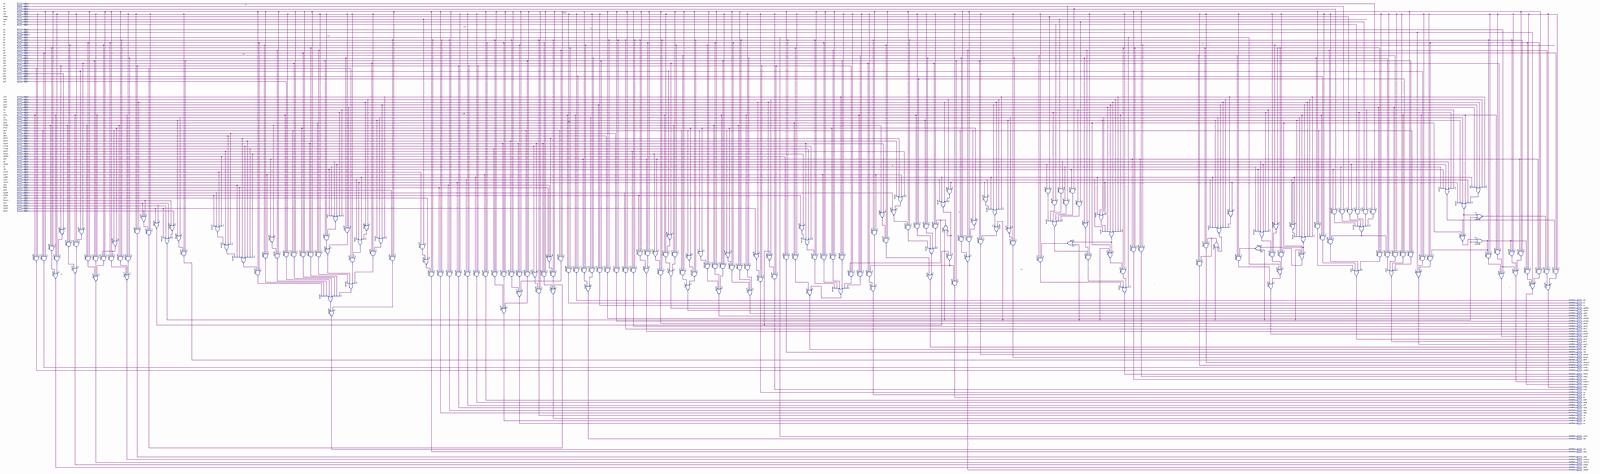
[diagram p0: schematic sheet, whole]
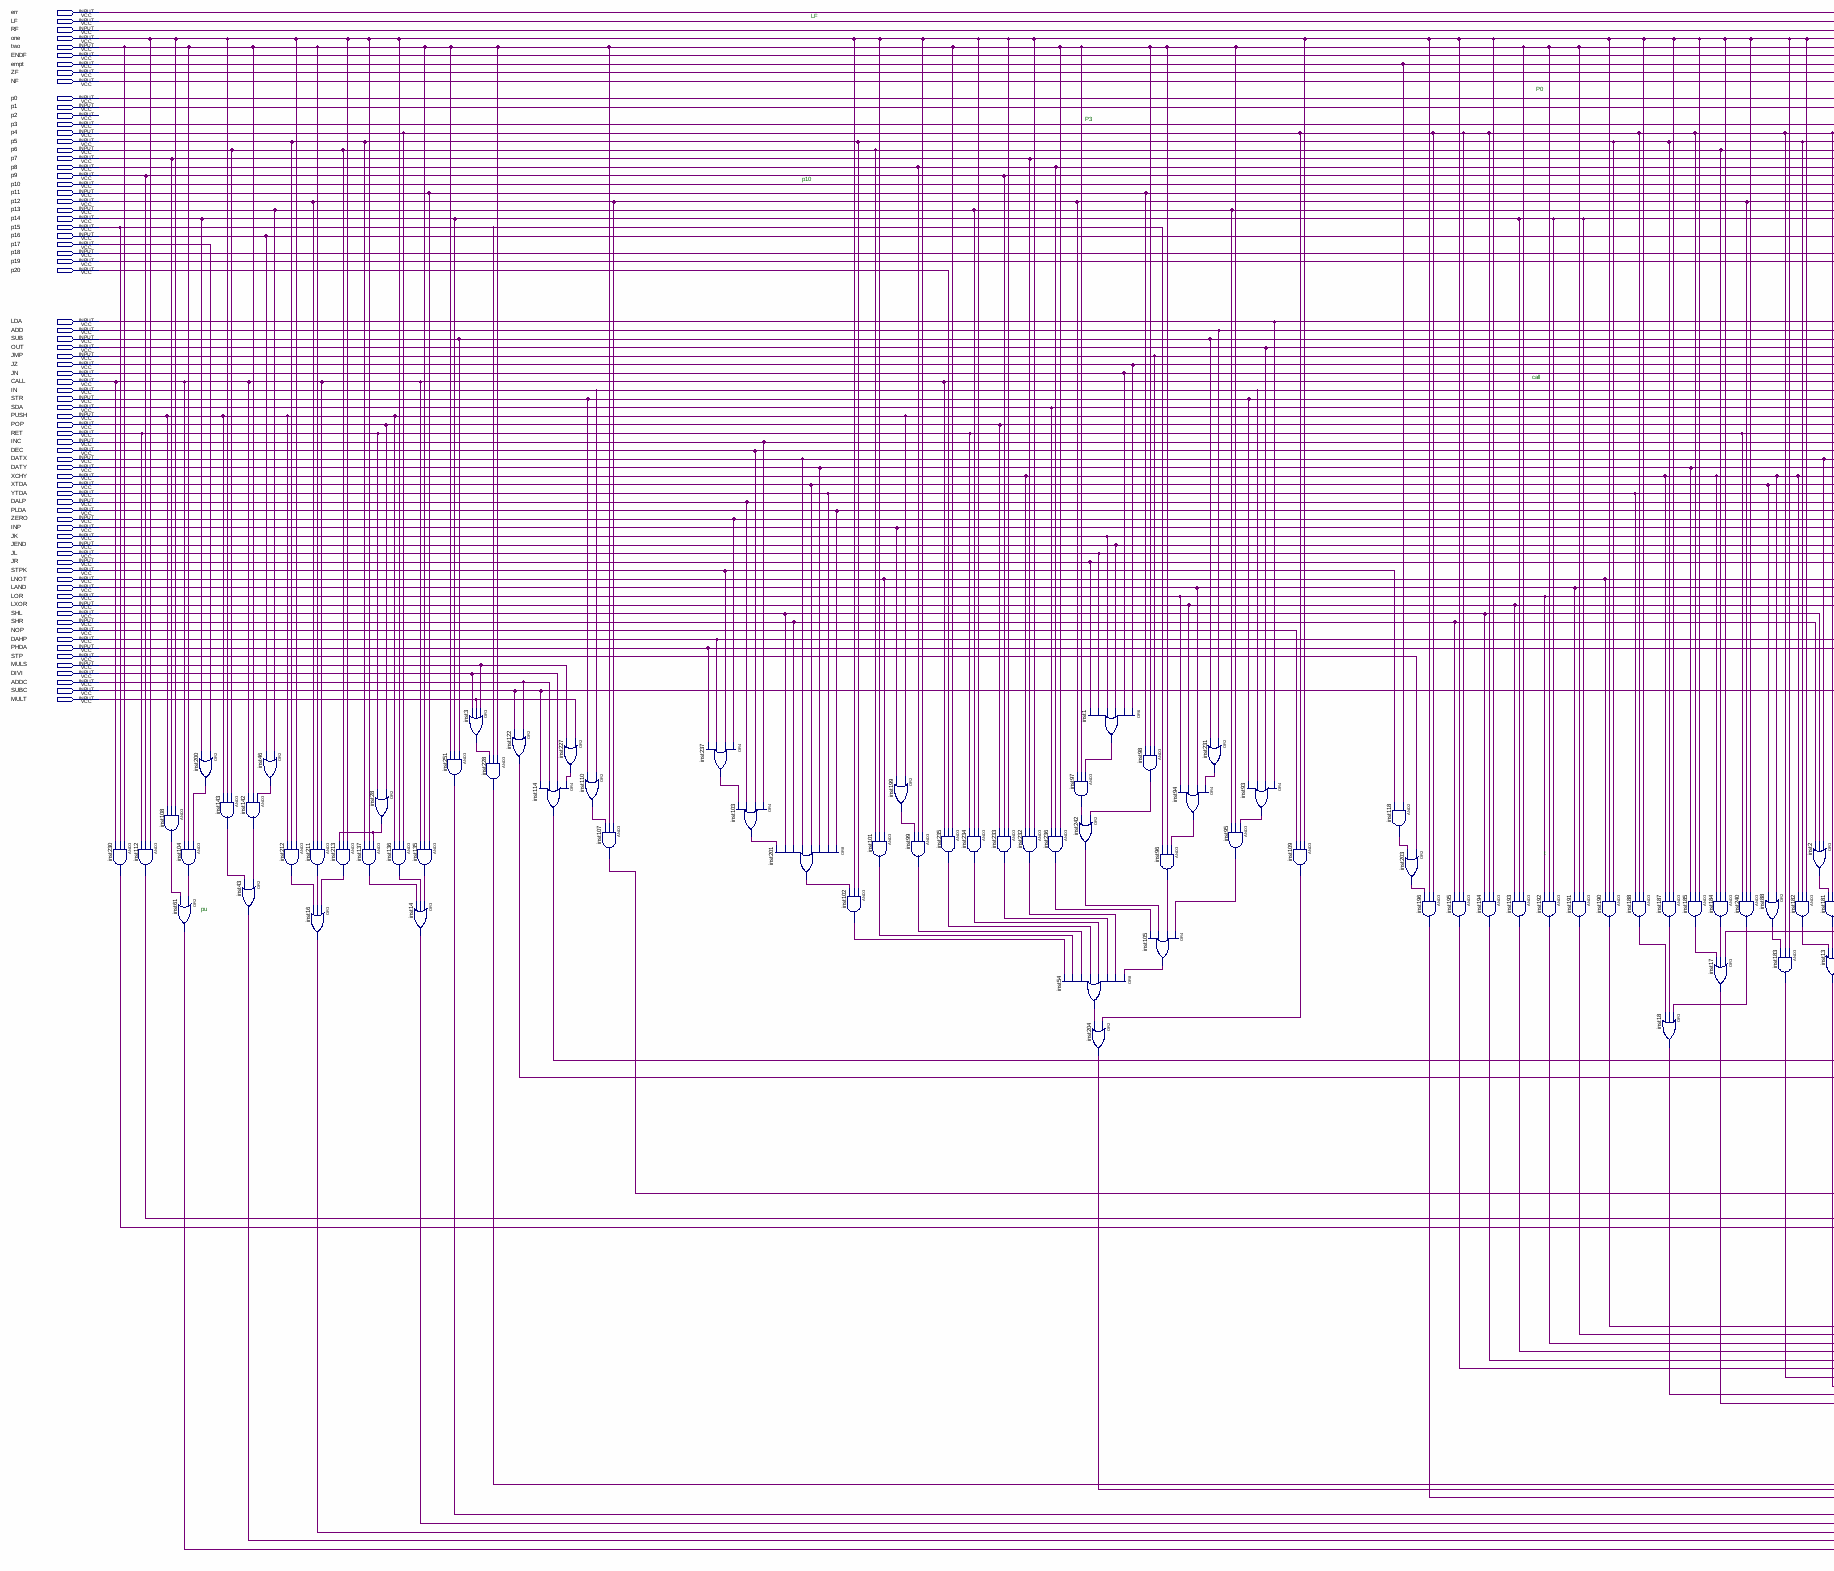
[diagram p1: schematic sheet, left part]
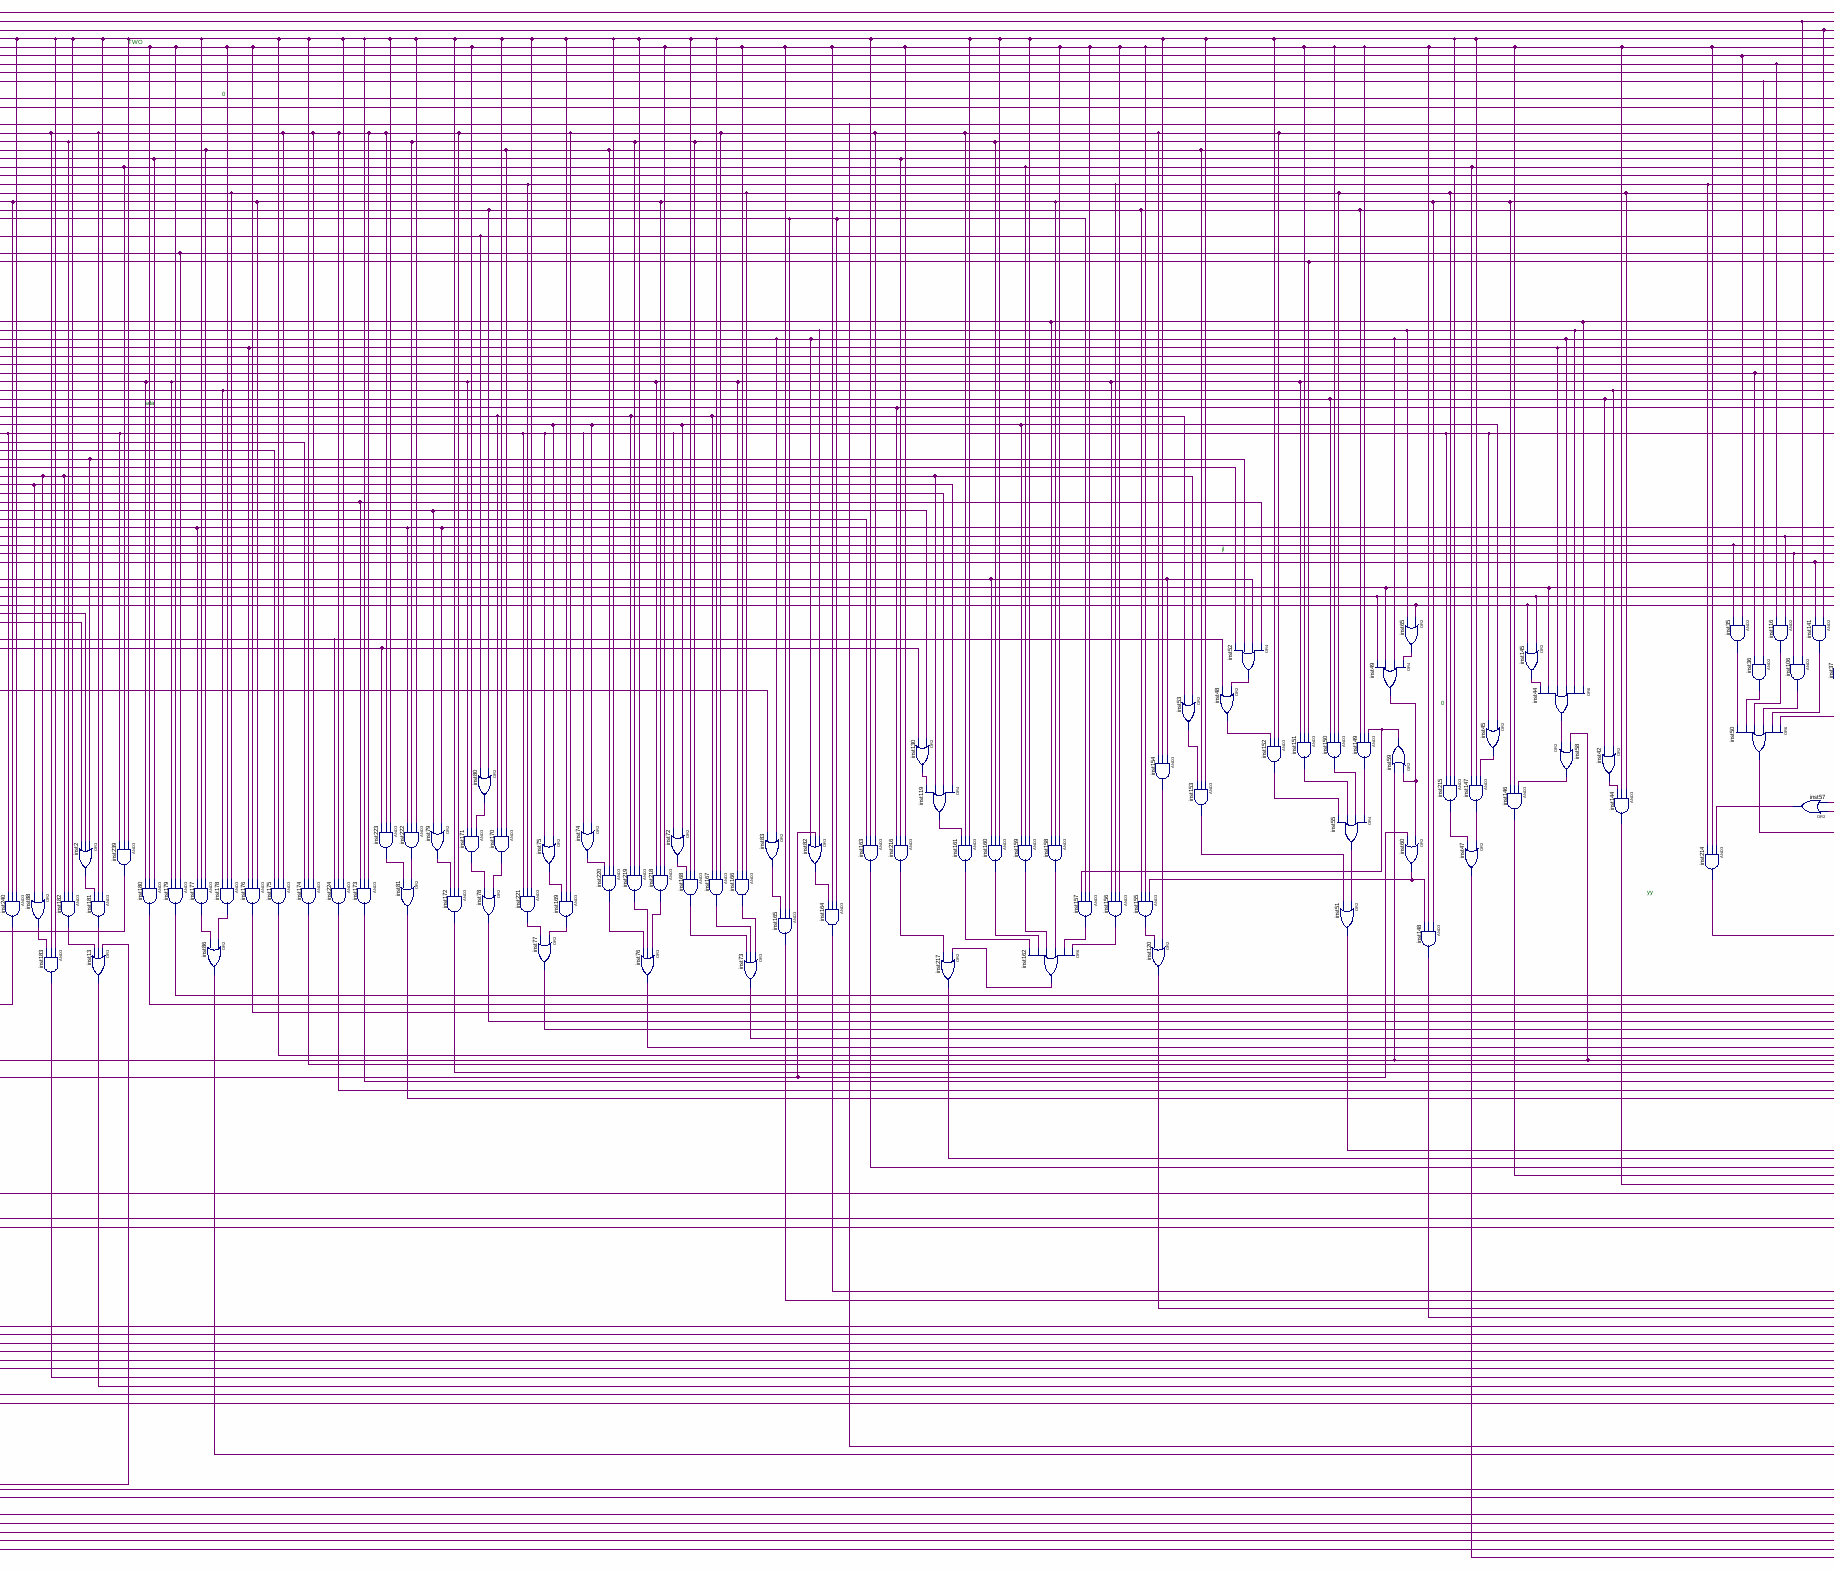
[diagram p2: schematic sheet, centre part]
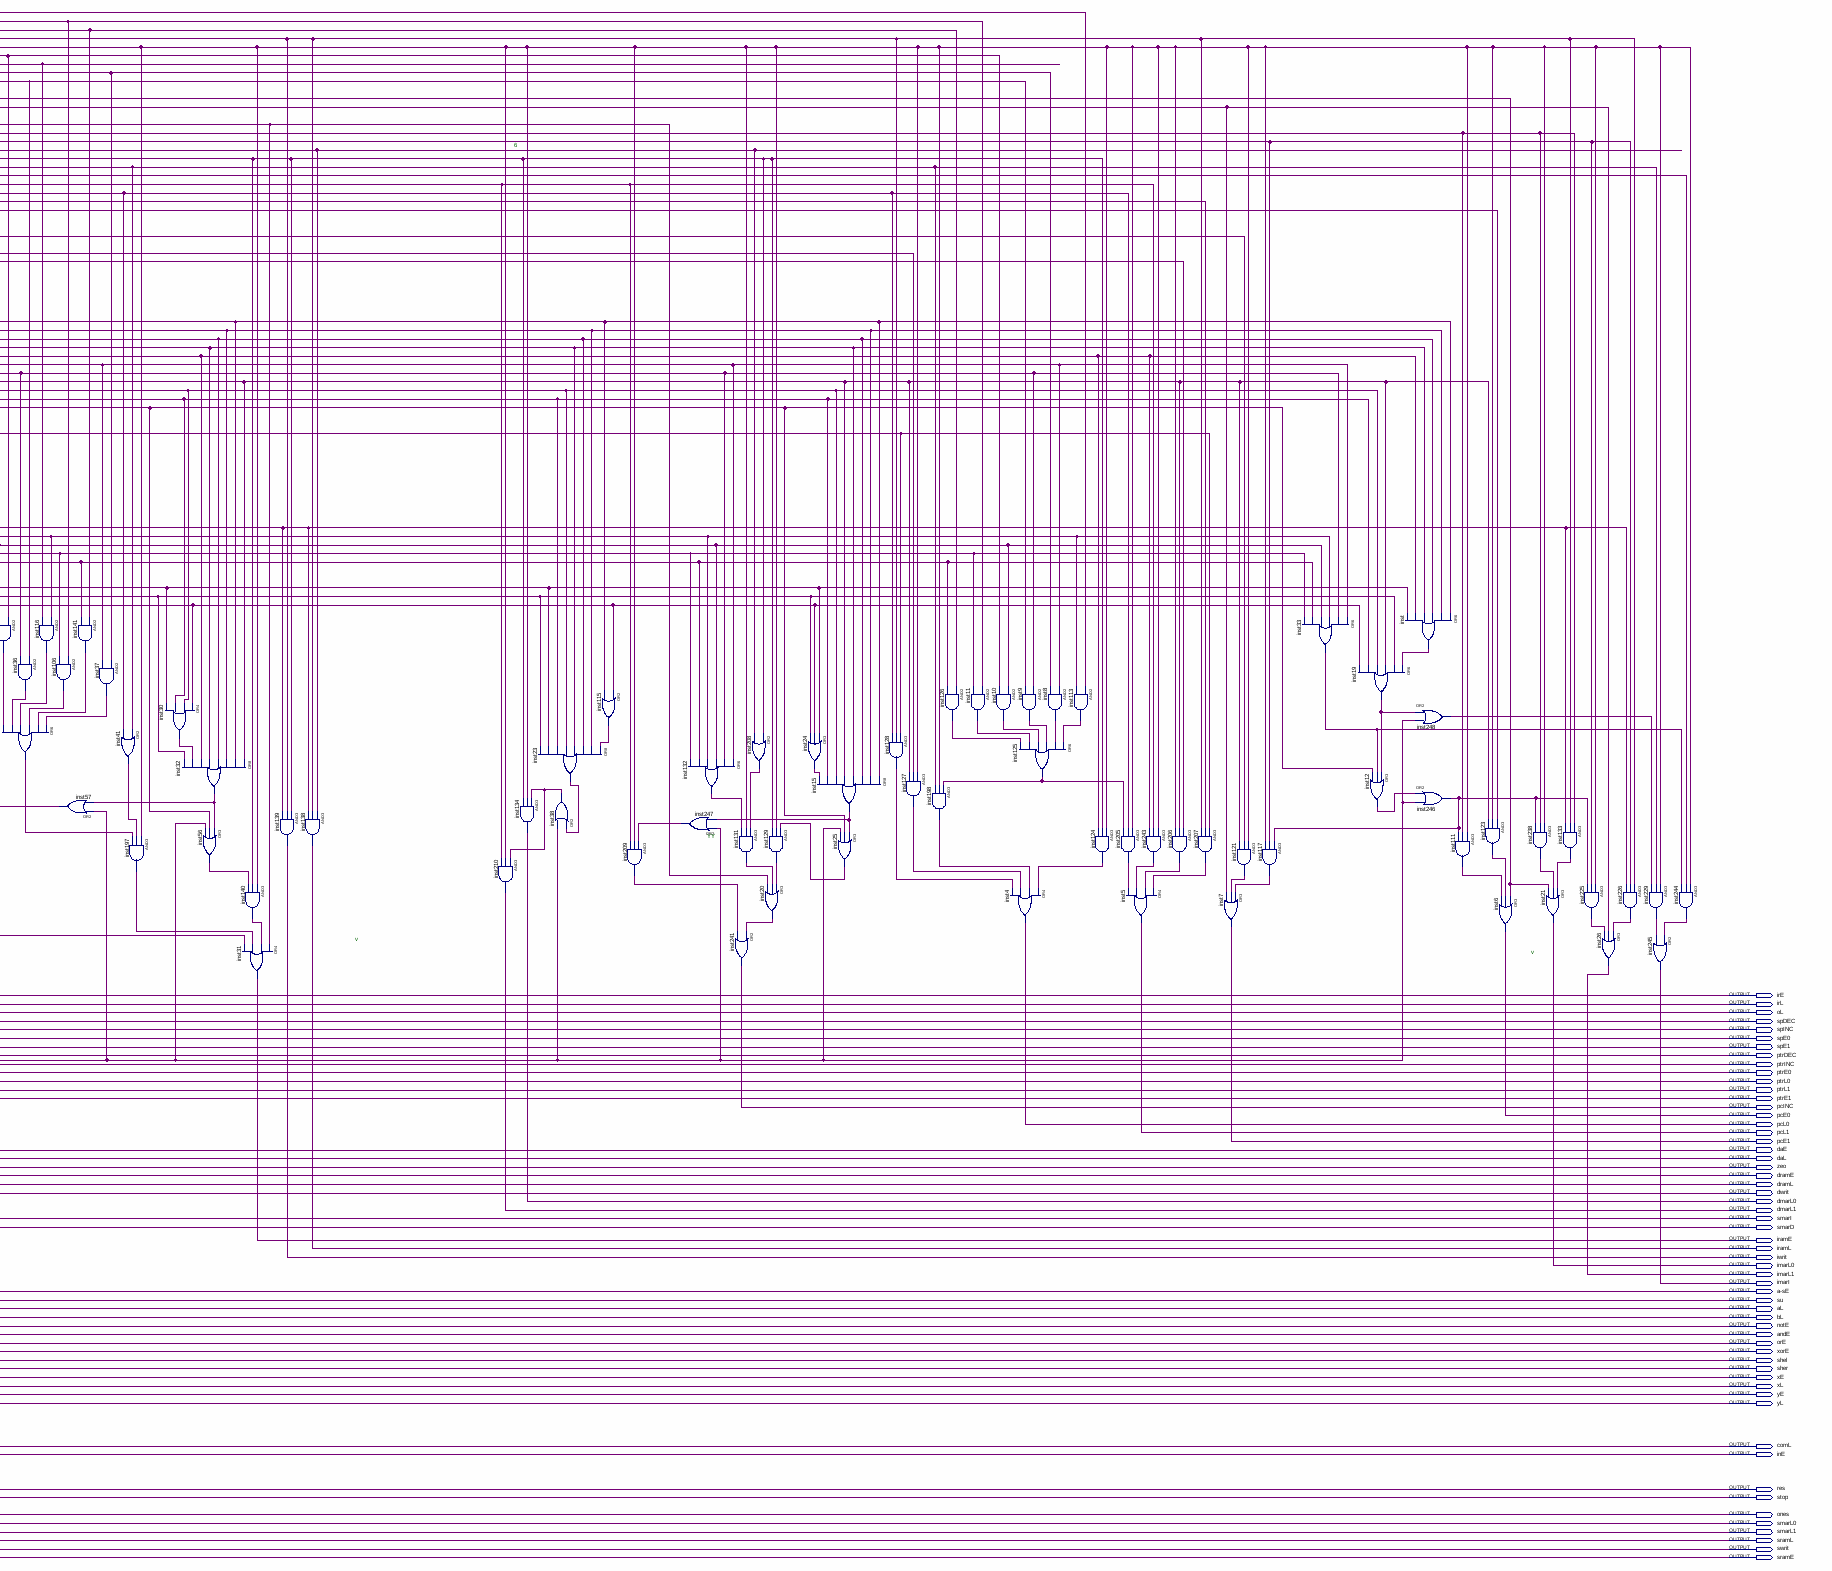
[diagram p3: schematic sheet, right part]
// Quartus schematic kzjz.bdf as structural Verilog: 224 symbols, 133 pins
module kzjz (
  input  err,
  input  LF,
  input  RF,
  input  one,
  input  two,
  input  ENDF,
  input  empt,
  input  ZF,
  input  NF,
  input  p0,
  input  p1,
  input  p2,
  input  p3,
  input  p4,
  input  p5,
  input  p6,
  input  p7,
  input  p8,
  input  p9,
  input  p10,
  input  p11,
  input  p12,
  input  p13,
  input  p14,
  input  p15,
  input  p16,
  input  p17,
  input  p18,
  input  p19,
  input  p20,
  input  LDA,
  input  ADD,
  input  SUB,
  input  OUT,
  input  JMP,
  input  JZ,
  input  JN,
  input  CALL,
  input  IN,
  input  STR,
  input  SDA,
  input  PUSH,
  input  POP,
  input  RET,
  input  INC,
  input  DEC,
  input  DATX,
  input  DATY,
  input  XCHY,
  input  XTDA,
  input  YTDA,
  input  DALP,
  input  PLDA,
  input  ZERO,
  input  INP,
  input  JK,
  input  JEND,
  input  JL,
  input  JR,
  input  STPK,
  input  LNOT,
  input  LAND,
  input  LOR,
  input  LXOR,
  input  SHL,
  input  SHR,
  input  NOP,
  input  DAHP,
  input  PHDA,
  input  STP,
  input  MULS,
  input  DIVI,
  input  ADDC,
  input  SUBC,
  input  MULT,
  output irE,
  output irL,
  output oL,
  output spDEC,
  output spINC,
  output spE0,
  output spE1,
  output ptrDEC,
  output ptrINC,
  output ptrE0,
  output ptrL0,
  output ptrL1,
  output ptrE1,
  output pcINC,
  output pcE0,
  output pcL0,
  output pcL1,
  output pcE1,
  output daE,
  output daL,
  output zeo,
  output dramE,
  output dramL,
  output dwrit,
  output dmarL0,
  output dmarL1,
  output smarI,
  output smarD,
  output iramE,
  output iramL,
  output iwrit,
  output imarL0,
  output imarL1,
  output imarI,
  output \a-sE ,
  output su,
  output aL,
  output bL,
  output notE,
  output andE,
  output orE,
  output xorE,
  output shel,
  output sher,
  output xE,
  output xL,
  output yE,
  output yL,
  output comL,
  output inE,
  output res,
  output stop,
  output ones,
  output smarL0,
  output smarL1,
  output sramL,
  output swrit,
  output sramE
);

  wire inst1_out, inst2_out, inst3_out, inst8_out, inst9_out, inst10_out, inst11_out, inst12_out, inst15_out,
       inst19_out, inst20_out, inst23_out, inst24_out, inst25_out, inst28_out, inst30_out, inst32_out,
       inst33_out, inst35_out, inst36_out, inst37_out, inst38_out, inst41_out, inst42_out, inst44_out,
       inst45_out, inst46_out, inst48_out, inst49_out, inst50_out, inst52_out, inst53_out, inst54_out,
       inst55_out, inst56_out, inst57_out, inst58_out, inst59_out, inst60_out, inst65_out, inst72_out,
       inst74_out, inst75_out, inst79_out, inst80_out, inst82_out, inst83_out, inst88_out, inst93_out,
       inst94_out, inst95_out, inst96_out, inst97_out, inst98_out, inst99_out, inst101_out, inst102_out,
       inst103_out, inst104_out, inst105_out, inst106_out, inst108_out, inst109_out, inst110_out,
       inst111_out, inst113_out, inst114_out, inst115_out, inst116_out, inst117_out, inst118_out,
       inst119_out, inst121_out, inst122_out, inst123_out, inst124_out, inst125_out, inst126_out,
       inst127_out, inst128_out, inst129_out, inst130_out, inst131_out, inst132_out, inst133_out,
       inst135_out, inst136_out, inst137_out, inst140_out, inst141_out, inst142_out, inst143_out,
       inst145_out, inst147_out, inst149_out, inst150_out, inst151_out, inst152_out, inst153_out,
       inst154_out, inst155_out, inst156_out, inst157_out, inst158_out, inst159_out, inst160_out,
       inst161_out, inst162_out, inst166_out, inst167_out, inst168_out, inst169_out, inst170_out,
       inst171_out, inst177_out, inst178_out, inst181_out, inst182_out, inst184_out, inst185_out,
       inst187_out, inst188_out, inst197_out, inst198_out, inst199_out, inst200_out, inst201_out,
       inst203_out, inst205_out, inst206_out, inst207_out, inst208_out, inst209_out, inst211_out,
       inst212_out, inst213_out, inst214_out, inst215_out, inst216_out, inst218_out, inst219_out,
       inst220_out, inst221_out, inst222_out, inst223_out, inst225_out, inst226_out, inst227_out,
       inst228_out, inst229_out, inst231_out, inst232_out, inst233_out, inst234_out, inst235_out,
       inst236_out, inst237_out, inst238_out, inst239_out, inst240_out, inst242_out, inst243_out,
       inst244_out, inst246_out, inst247_out, inst248_out, inst_out;

  and inst112 (smarI, one, p9, RET);
  and inst230 (smarD, two, p15, CALL);
  and inst108 (inst108_out, one, p7, PUSH);
  or inst61 (swrit, inst104_out, inst108_out);
  or inst200 (inst200_out, p17, p14);
  and inst104 (inst104_out, inst200_out, two, CALL);
  and inst142 (inst142_out, inst46_out, two, CALL);
  and inst143 (inst143_out, p6, one, PUSH);
  or inst43 (sramL, inst142_out, inst143_out);
  or inst46 (inst46_out, p13, p16);
  and inst211 (inst211_out, CALL, two, p12);
  and inst212 (inst212_out, one, p5, PUSH);
  or inst16 (smarL1, inst213_out, inst211_out, inst212_out);
  and inst213 (inst213_out, one, p6, inst28_out);
  or inst28 (inst28_out, POP, RET);
  and inst137 (inst137_out, inst28_out, one, p5);
  and inst135 (inst135_out, p11, two, CALL);
  and inst136 (inst136_out, p4, one, PUSH);
  or inst14 (smarL0, inst135_out, inst136_out, inst137_out);
  and inst251 (ones, SUB, p14, two);
  or inst3 (inst3_out, MULS, MULT, DIVI);
  and inst228 (inst228_out, two, p15, inst3_out);
  or inst122 (inst122_out, ADDC, SUBC);
  or inst114 (inst114_out, inst227_out, DIVI, ADDC, SUBC);
  or inst227 (inst227_out, MULT, MULS);
  or inst110 (inst110_out, IN, STR);
  and inst107 (dwrit, p12, two, inst110_out);
  or inst237 (inst237_out, ZERO, STPK, DAHP, PHDA);
  or inst103 (inst103_out, INC, DEC, DALP, inst237_out);
  or inst201 (inst201_out, PLDA, YTDA, DATY, XTDA, DATX, SHR, SHL, inst103_out);
  and inst102 (inst102_out, p5, one, inst201_out);
  or inst199 (inst199_out, PUSH, INP);
  and inst101 (inst101_out, LNOT, one, p6);
  and inst99 (inst99_out, one, p8, inst199_out);
  and inst234 (inst234_out, one, p13, RET);
  and inst235 (inst235_out, two, p20, CALL);
  and inst233 (inst233_out, one, p9, POP);
  and inst232 (inst232_out, one, p7, XCHY);
  and inst236 (inst236_out, two, p8, SDA);
  or inst54 (inst54_out, inst105_out, inst232_out, inst233_out, inst234_out, inst235_out, inst99_out, inst101_out, inst102_out);
  or inst1 (inst1_out, JZ, JN, JEND, JK, JL, JR);
  and inst97 (inst97_out, inst1_out, two, p12);
  or inst242 (inst242_out, inst98_out, inst97_out);
  or inst204 (res, inst109_out, inst54_out);
  and inst98 (inst98_out, JMP, two, p11);
  and inst96 (inst96_out, inst94_out, two, p15);
  or inst105 (inst105_out, inst95_out, inst96_out, inst242_out, inst236_out);
  or inst231 (inst231_out, ADD, SUB);
  or inst94 (inst94_out, inst231_out, LAND, LXOR, LOR);
  and inst95 (inst95_out, inst93_out, two, p13);
  or inst93 (inst93_out, LDA, OUT, IN, STR);
  and inst109 (inst109_out, one, p4, NOP);
  and inst118 (inst118_out, empt, STPK);
  or inst203 (inst203_out, STP, inst118_out);
  and inst196 (stop, p4, one, inst203_out);
  and inst194 (shel, one, p4, SHL);
  and inst195 (sher, p4, one, SHR);
  and inst193 (xorE, two, p14, LXOR);
  and inst192 (orE, p14, two, LOR);
  and inst191 (andE, p14, two, LAND);
  and inst190 (notE, p5, one, LNOT);
  and inst188 (inst188_out, one, p4, YTDA);
  and inst185 (inst185_out, one, p4, DATY);
  and inst187 (inst187_out, one, p5, XCHY);
  or inst18 (yE, inst240_out, inst187_out, inst188_out);
  and inst184 (inst184_out, one, p6, XCHY);
  or inst17 (yL, inst239_out, inst184_out, inst185_out);
  and inst240 (inst240_out, one, p12, RET);
  or inst88 (inst88_out, XCHY, XTDA);
  and inst183 (xE, one, p4, inst88_out);
  or inst2 (inst2_out, DATX, SHL, SHR);
  and inst181 (inst181_out, one, p4, inst2_out);
  and inst182 (inst182_out, one, p5, XCHY);
  or inst13 (xL, inst228_out, inst181_out, inst182_out);
  and inst239 (inst239_out, one, p8, RET);
  and inst180 (irL, p7, two, CALL);
  and inst177 (inst177_out, p6, one, INP);
  and inst179 (irE, p18, two, CALL);
  and inst178 (inst178_out, p11, two, IN);
  or inst86 (inE, inst178_out, inst177_out);
  and inst176 (oL, p12, two, OUT);
  and inst175 (ptrDEC, p4, one, DEC);
  and inst174 (ptrINC, p4, one, INC);
  and inst224 (ptrL1, one, p4, DAHP);
  and inst173 (ptrL0, p4, one, DALP);
  and inst223 (inst223_out, one, p4, PHDA);
  or inst81 (ptrE1, inst222_out, inst223_out);
  or inst79 (inst79_out, INP, PLDA);
  and inst222 (inst222_out, one, p5, INP);
  and inst171 (inst171_out, inst80_out, two, CALL);
  and inst172 (ptrE0, p4, one, inst79_out);
  or inst80 (inst80_out, p13, p16);
  and inst170 (inst170_out, p6, one, PUSH);
  or inst78 (spDEC, inst170_out, inst171_out);
  and inst221 (inst221_out, one, p10, RET);
  or inst77 (spINC, inst169_out, inst221_out);
  or inst75 (inst75_out, POP, RET);
  and inst169 (inst169_out, p4, one, inst75_out);
  or inst74 (inst74_out, POP, RET);
  and inst220 (inst220_out, one, p6, inst74_out);
  and inst219 (inst219_out, one, p5, PUSH);
  or inst76 (spE1, inst218_out, inst219_out, inst220_out);
  or inst72 (inst72_out, POP, RET);
  and inst218 (inst218_out, two, p12, CALL);
  and inst167 (inst167_out, p4, one, PUSH);
  and inst168 (inst168_out, p5, one, inst72_out);
  and inst166 (inst166_out, p11, two, CALL);
  or inst73 (spE0, inst166_out, inst167_out, inst168_out);
  or inst83 (inst83_out, SUB, SUBC);
  and inst165 (su, p14, two, inst83_out);
  or inst82 (inst82_out, ADD, inst122_out, SUB);
  and inst164 (\a-sE , p14, two, inst82_out);
  and inst163 (zeo, p4, one, ZERO);
  or inst130 (inst130_out, PLDA, PHDA);
  and inst216 (inst216_out, two, p7, SDA);
  or inst119 (inst119_out, XTDA, YTDA, XCHY, inst130_out);
  or inst217 (daL, inst162_out, inst216_out);
  and inst161 (inst161_out, one, p4, inst119_out);
  and inst159 (inst159_out, one, p8, POP);
  and inst160 (inst160_out, one, p5, LNOT);
  and inst158 (inst158_out, two, p12, LDA);
  or inst162 (inst162_out, inst156_out, inst157_out, inst158_out, inst159_out, inst160_out, inst161_out);
  and inst157 (inst157_out, two, p14, inst59_out);
  and inst156 (inst156_out, two, p10, CALL);
  and inst154 (inst154_out, LNOT, one, p4);
  and inst155 (inst155_out, inst60_out, two, p13);
  or inst120 (aL, inst154_out, inst155_out);
  or inst53 (inst53_out, XCHY, PUSH);
  or inst48 (inst48_out, inst52_out, DAHP);
  and inst153 (inst153_out, one, p6, inst53_out);
  or inst52 (inst52_out, DALP, LNOT, DATX, DATY);
  and inst152 (inst152_out, p4, one, inst48_out);
  and inst150 (inst150_out, p11, two, STR);
  and inst151 (inst151_out, p19, two, CALL);
  and inst149 (inst149_out, inst59_out, two, p13);
  or inst55 (inst55_out, inst149_out, inst150_out, inst151_out, inst152_out);
  or inst51 (daE, inst55_out, inst153_out);
  or inst49 (inst49_out, inst65_out, SUB, LAND, LOR);
  or inst59 (inst59_out, inst49_out, inst114_out);
  or inst65 (inst65_out, LXOR, ADD);
  or inst60 (inst60_out, inst49_out, inst122_out);
  and inst148 (bL, p12, two, inst60_out);
  and inst215 (inst215_out, one, p11, RET);
  or inst47 (sramE, inst147_out, inst215_out);
  or inst45 (inst45_out, POP, RET);
  and inst147 (inst147_out, inst45_out, one, p8);
  or inst145 (inst145_out, LOR, LXOR);
  and inst146 (dramE, inst58_out, two, p12);
  or inst44 (inst44_out, LDA, ADD, SUB, OUT, LAND, inst145_out);
  or inst58 (inst58_out, inst44_out, inst114_out);
  or inst42 (inst42_out, IN, STR);
  and inst144 (dramL, p11, two, inst42_out);
  and inst214 (inst214_out, inst57_out, two, p10);
  and inst35 (inst35_out, ENDF, JEND);
  or inst50 (inst50_out, inst37_out, inst141_out, inst106_out, inst116_out, inst36_out, inst35_out);
  and inst116 (inst116_out, JK, empt);
  and inst36 (inst36_out, NF, JN);
  and inst106 (inst106_out, LF, JL);
  or inst57 (inst57_out, inst114_out, inst32_out);
  and inst141 (inst141_out, RF, JR);
  and inst37 (inst37_out, ZF, JZ);
  or inst41 (inst41_out, p8, p11);
  and inst197 (inst197_out, two, inst41_out, inst50_out);
  or inst30 (inst30_out, LXOR, IN, STR, LAND);
  or inst32 (inst32_out, CALL, LDA, ADD, SUB, OUT, JMP, inst30_out, LOR);
  or inst56 (inst56_out, inst32_out, SDA, inst114_out);
  and inst140 (inst140_out, two, p7, inst56_out);
  or inst31 (iramE, p3, inst140_out, inst197_out, inst214_out);
  and inst139 (iwrit, p7, one, INP);
  and inst138 (iramL, p6, one, INP);
  and inst134 (dmarL0, inst38_out, two, p7);
  and inst210 (dmarL1, inst38_out, two, p10);
  or inst23 (inst23_out, inst115_out, ADD, SUB, OUT, IN, STR, LAND, LOR);
  or inst38 (inst38_out, inst23_out, inst114_out);
  or inst115 (inst115_out, LXOR, LDA);
  and inst209 (inst209_out, inst247_out, two, p10);
  or inst132 (inst132_out, JZ, JN, JEND, JK, JR, JL);
  or inst247 (inst247_out, inst114_out, inst15_out);
  or inst208 (inst208_out, p7, p6);
  and inst131 (inst131_out, inst208_out, two, inst132_out);
  or inst241 (pcINC, inst20_out, inst209_out);
  and inst129 (inst129_out, inst25_out, two, p7);
  or inst20 (inst20_out, inst129_out, inst131_out, p3);
  or inst24 (inst24_out, LAND, LXOR, LOR);
  or inst15 (inst15_out, LDA, ADD, SUB, OUT, CALL, IN, STR, inst24_out);
  or inst25 (inst25_out, inst15_out, SDA, inst114_out);
  and inst128 (inst128_out, RET, one, p11);
  and inst127 (inst127_out, two, p18, CALL);
  and inst198 (inst198_out, inst125_out, two, p8);
  and inst126 (inst126_out, RF, JR);
  and inst10 (inst10_out, JEND, ENDF);
  and inst11 (inst11_out, LF, JL);
  and inst9 (inst9_out, JN, NF);
  or inst125 (inst125_out, inst113_out, inst8_out, inst9_out, inst10_out, inst11_out, inst126_out);
  or inst4 (pcL0, inst124_out, inst198_out, inst127_out, inst128_out);
  and inst8 (inst8_out, JZ, ZF);
  and inst113 (inst113_out, err, JK);
  and inst124 (inst124_out, two, p7, JMP);
  and inst205 (inst205_out, two, p11, inst125_out);
  or inst5 (pcL1, inst207_out, inst206_out, inst243_out, inst205_out);
  and inst206 (inst206_out, p19, CALL, two);
  and inst243 (inst243_out, two, p10, JMP);
  and inst207 (inst207_out, RET, p12, one);
  and inst121 (inst121_out, two, p16, CALL);
  or inst7 (pcE1, inst117_out, inst121_out, p1);
  and inst117 (inst117_out, inst246_out, p5, two);
  or inst33 (inst33_out, JZ, JN, JK, JEND, JR, JL);
  or inst19 (inst19_out, inst_out, LOR, CALL, IN, STR, LXOR);
  or inst12 (inst12_out, inst19_out, inst33_out, SDA);
  or inst (inst_out, LDA, ADD, SUB, OUT, JMP, LAND);
  or inst248 (inst248_out, inst19_out, inst114_out);
  or inst246 (inst246_out, inst12_out, inst114_out);
  and inst111 (inst111_out, two, p4, inst246_out);
  and inst123 (inst123_out, p13, two, CALL);
  or inst6 (pcE0, p0, inst123_out, inst111_out);
  and inst238 (inst238_out, two, p4, inst246_out);
  or inst21 (imarL0, inst133_out, inst238_out, p0);
  and inst133 (inst133_out, p4, one, INP);
  and inst225 (inst225_out, two, p5, inst246_out);
  or inst26 (imarL1, inst226_out, p1, inst225_out);
  and inst226 (inst226_out, one, p5, INP);
  and inst229 (inst229_out, two, p8, inst248_out);
  or inst245 (imarI, inst244_out, inst229_out);
  and inst244 (inst244_out, two, p9, inst33_out);

  assign comL = p3;

  // Notes on the sheet:
  //   LF
  //   TWO
  //   P0
  //   0
  //   P3
  //   6
  //   p10
  //   call
  //   sda
  //   jl
  //   0
  //   YY
  //   t
  //   yy
  //   pu
  //   v
  //   v
endmodule
